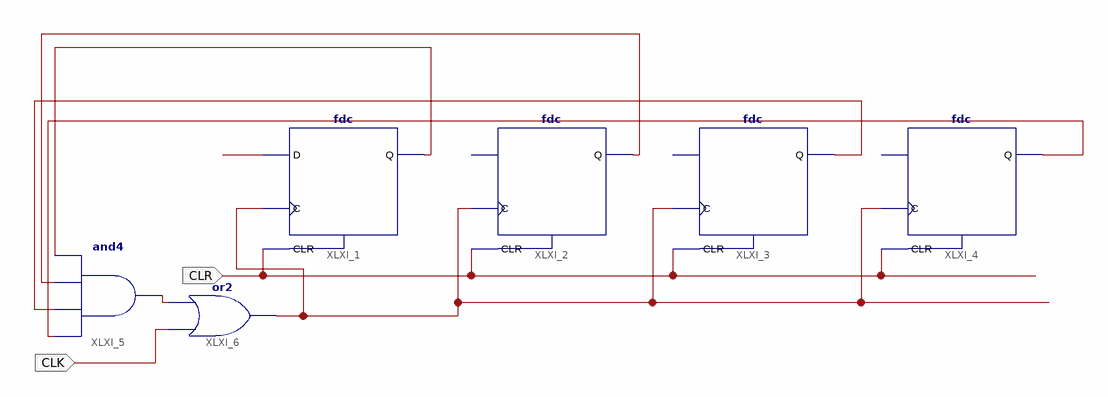
[diagram p0: schematic sheet 1]
// Xilinx ISE schematic p3ej1.sch (spartan3e) as structural Verilog: 6 symbols, 2 ports
module p3ej1 (
  input  CLK,
  input  CLR
);

  wire XLXN_12, XLXN_18, XLXN_26, XLXN_27, XLXN_28, XLXN_29;

  fdc XLXI_1 (.C(CLK), .CLR(CLR), .D(XLXN_12), .Q(XLXN_26));
  fdc XLXI_2 (.C(CLK), .CLR(CLR), .Q(XLXN_27));  // open: D
  fdc XLXI_3 (.C(CLK), .CLR(CLR), .Q(XLXN_28));  // open: D
  fdc XLXI_4 (.C(CLK), .CLR(CLR), .Q(XLXN_29));  // open: D
  and XLXI_5 (XLXN_18, XLXN_26, XLXN_27, XLXN_28, XLXN_29);
  or XLXI_6 (CLK, XLXN_18, CLK);
endmodule
